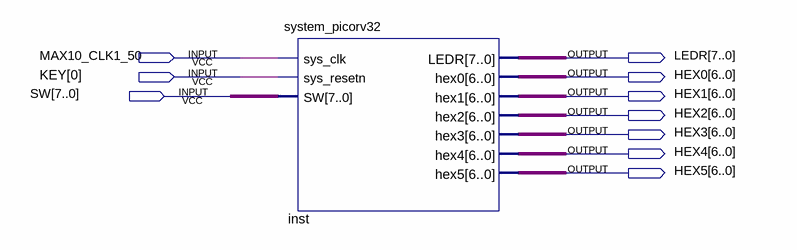
[diagram p0: schematic sheet]
// Quartus schematic quartus_mini_sys_riscv.bdf as structural Verilog: 1 symbols, 10 pins
module quartus_mini_sys_riscv (
  input  MAX10_CLK1_50,
  input  [0:0] KEY,
  input  [7:0] SW,
  output [7:0] LEDR,
  output [6:0] HEX0,
  output [6:0] HEX1,
  output [6:0] HEX2,
  output [6:0] HEX3,
  output [6:0] HEX4,
  output [6:0] HEX5
);

  system_picorv32 inst (
    .sys_clk(MAX10_CLK1_50), .sys_resetn(KEY[0]), .SW(SW), .LEDR(LEDR), .hex0(HEX0), .hex1(HEX1),
    .hex2(HEX2), .hex3(HEX3), .hex4(HEX4), .hex5(HEX5));
endmodule
